# EasyEDA Pro project power_suply.eprj

# Schematic Schematic1
Board Name: Board1; Create Date: 2025-09-13; Page Name: main board; Project Name: power_suply; Schematic Name: Schematic1; Update Date: 2025-09-17; Company: EasyEDA.com; Page Size: A4; Version: V1.0
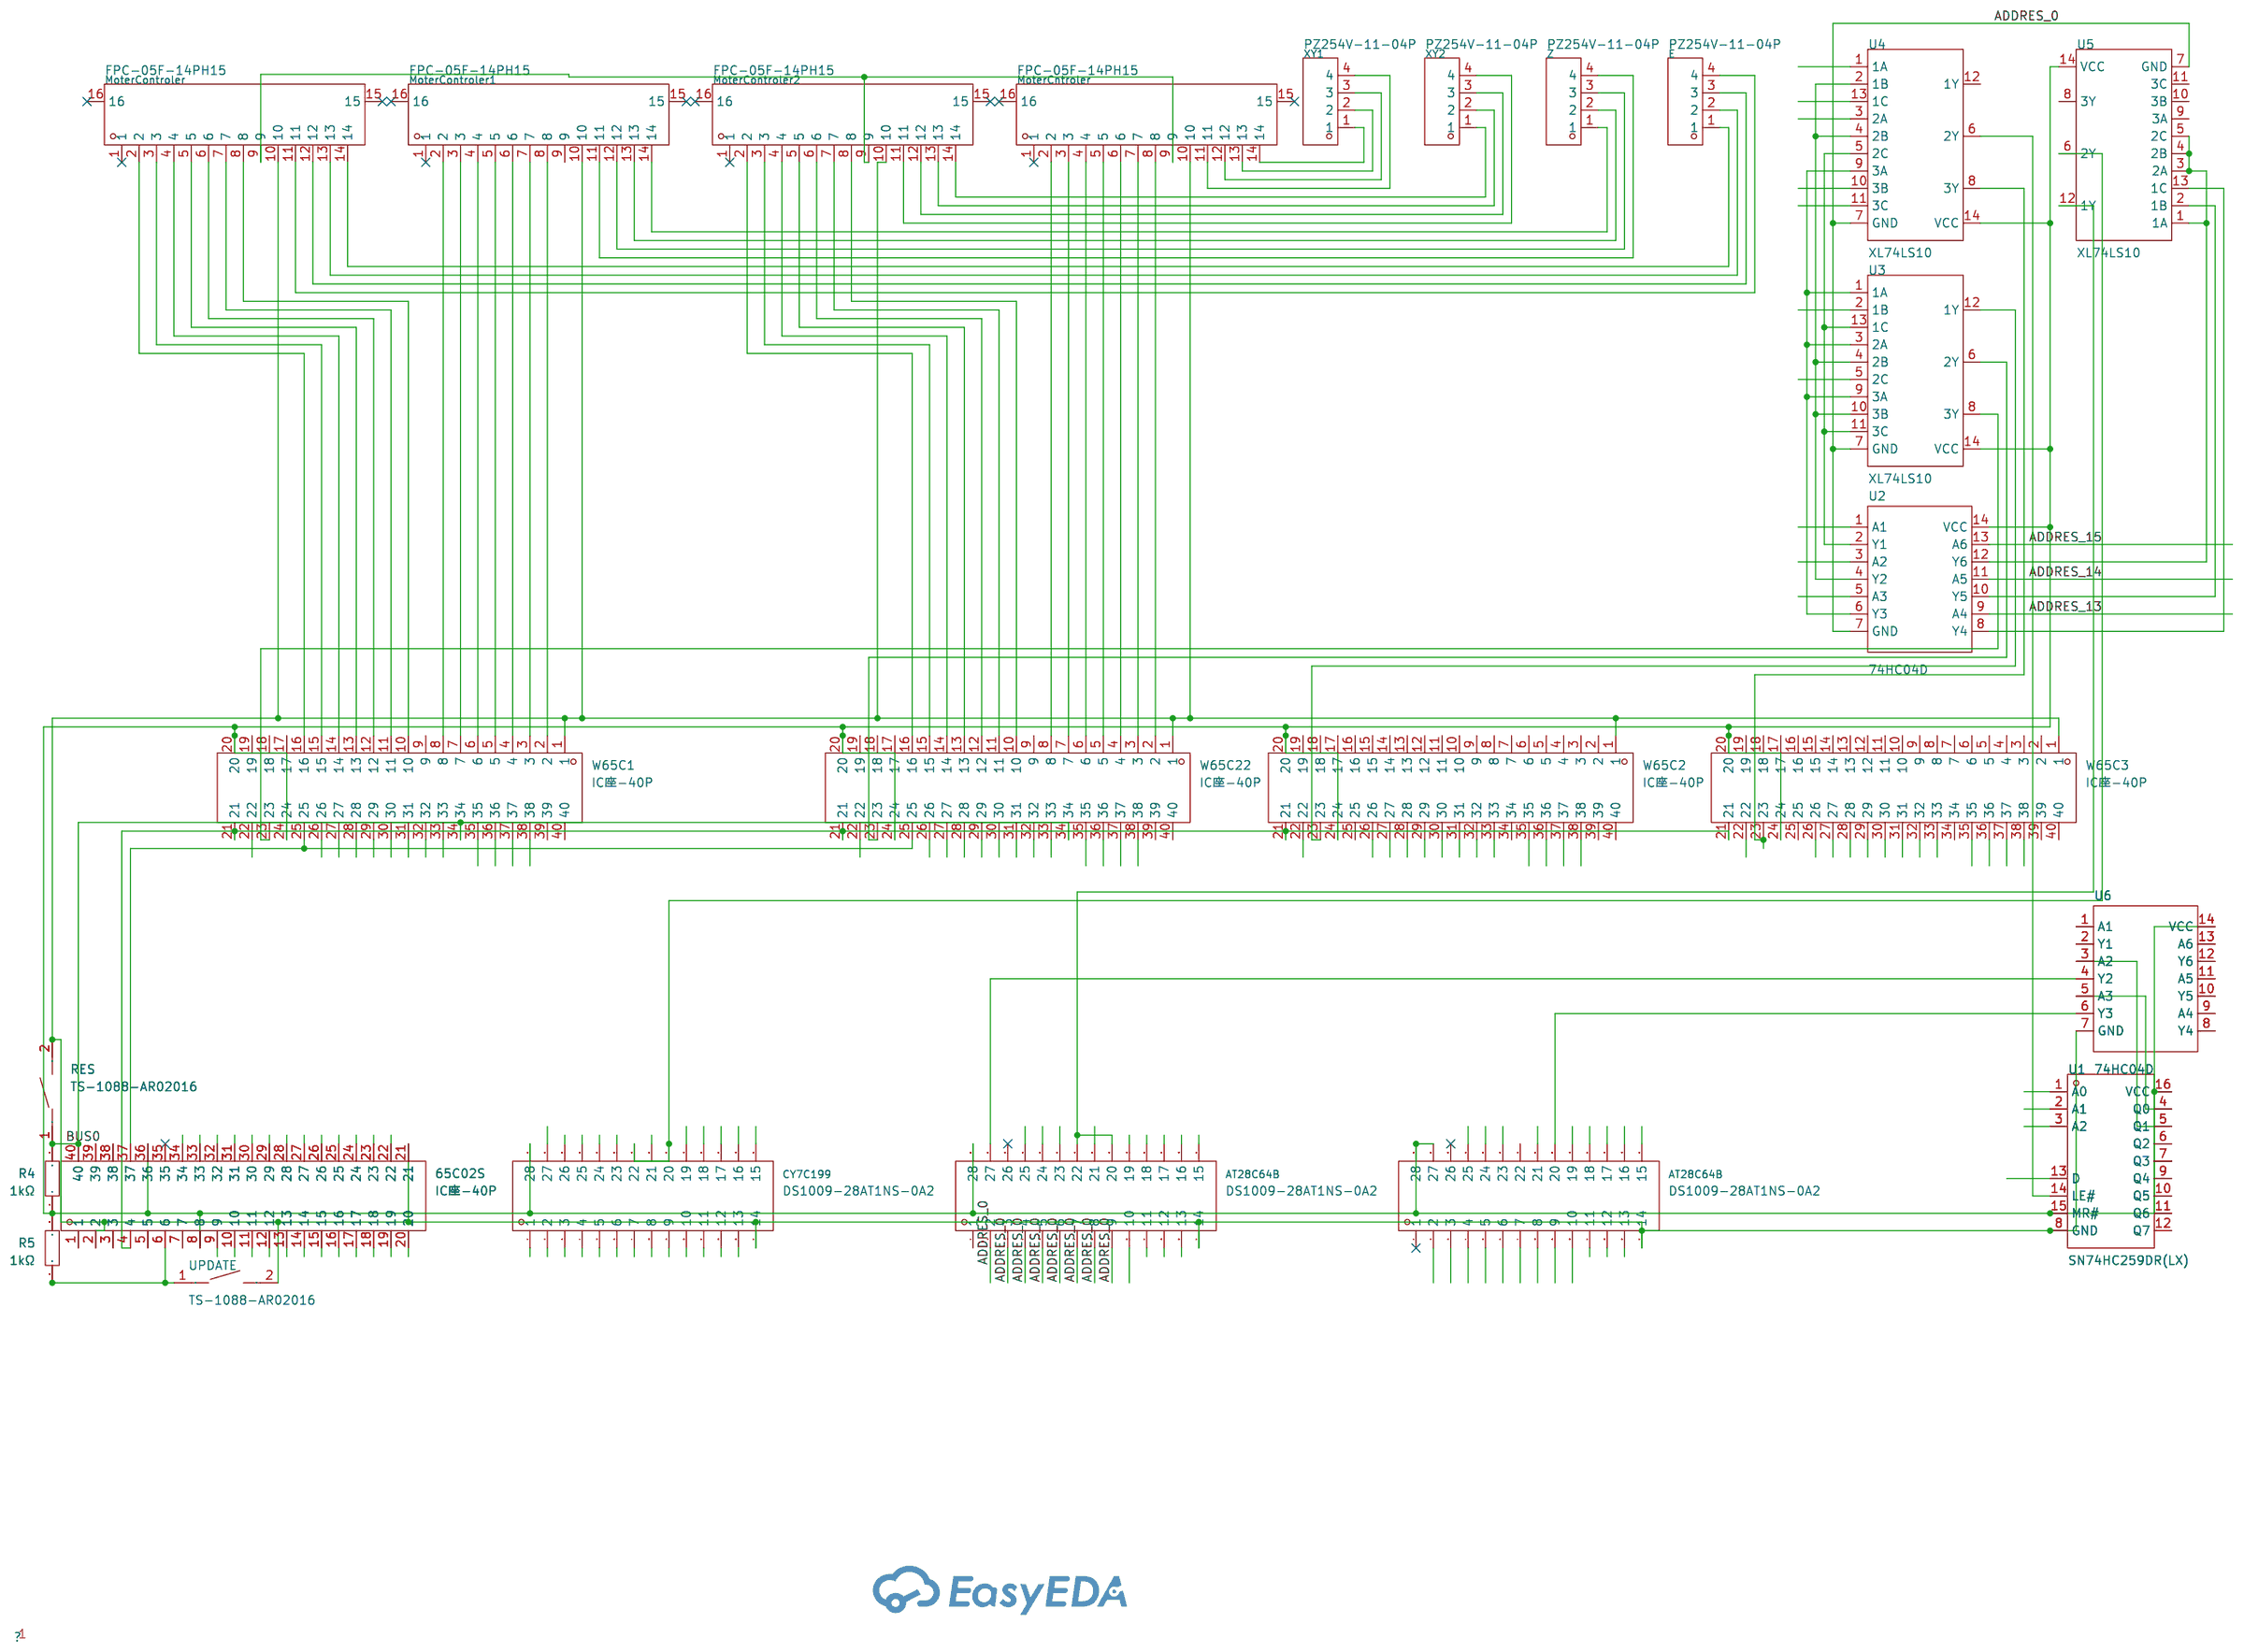
[diagram p0: schematic sheet]

## Parts
65C02S  IC座-40P  [DIP-40_L50.8-W17.8-P2.54-LS15.2-BL]
AT28C64B  DS1009-28AT1NS-0A2  [DIP-28_L35.6-W10.2-P2.54-LS7.6-BL-2]
AT28C64B#2  DS1009-28AT1NS-0A2  [DIP-28_L35.6-W10.2-P2.54-LS7.6-BL-2]
CY7C199  DS1009-28AT1NS-0A2  [DIP-28_L35.6-W10.2-P2.54-LS7.6-BL-2]
E  PZ254V-11-04P  [HDR-TH_4P-P2.54-V-M]
MoterCntroler  FPC-05F-14PH15  [FPC-SMD_14P-P0.50_XUNPU_FPC-05F-14PH15]
MoterControler  FPC-05F-14PH15  [FPC-SMD_14P-P0.50_XUNPU_FPC-05F-14PH15]
MoterControler1  FPC-05F-14PH15  [FPC-SMD_14P-P0.50_XUNPU_FPC-05F-14PH15]
MoterControler2  FPC-05F-14PH15  [FPC-SMD_14P-P0.50_XUNPU_FPC-05F-14PH15]
R4  1kΩ  [R0603]
R5  1kΩ  [R0603]
RES  TS-1088-AR02016  [SW-SMD_L3.9-W3.0-P4.45]
U1  SN74HC259DR(LX)  [SOP-16_L9.9-W3.9-P1.27-LS6.0-BL]
U2  74HC04D  [DIP-14_L19.2-W6.6-P2.54-LS10.9-BL]
U3  XL74LS10  [SOP-14_L8.6-W3.9-P1.27-LS6.0-BL]
U4  XL74LS10  [SOP-14_L8.6-W3.9-P1.27-LS6.0-BL]
U5  XL74LS10  [SOP-14_L8.6-W3.9-P1.27-LS6.0-BL]
U6  74HC04D  [DIP-14_L19.2-W6.6-P2.54-LS10.9-BL]
UPDATE  TS-1088-AR02016  [SW-SMD_L3.9-W3.0-P4.45]
W65C1  IC座-40P  [DIP-40_L50.8-W17.8-P2.54-LS15.2-BL]
W65C2  IC座-40P  [DIP-40_L50.8-W17.8-P2.54-LS15.2-BL]
W65C3  IC座-40P  [DIP-40_L50.8-W17.8-P2.54-LS15.2-BL]
W65C22  IC座-40P  [DIP-40_L50.8-W17.8-P2.54-LS15.2-BL]
XY1  PZ254V-11-04P  [HDR-TH_4P-P2.54-V-M]
XY2  PZ254V-11-04P  [HDR-TH_4P-P2.54-V-M]
Z  PZ254V-11-04P  [HDR-TH_4P-P2.54-V-M]

## Library data of the parts
65C02S W65C22 = IC座-40P: LCSC Part Name: 间距2.54mm P数:40P; Supplier Part: C2332; Manufacturer: BOOMELE(博穆精密); Supplier Footprint: DIP-40; JLCPCB Part Class: Extended Part; Datasheet: https://item.szlcsc.com/datasheet/IC%25E5%25BA%25A7-40P/2706.html; Supplier: LCSC; Adaptation Package Type: DIP; Pitch: 2.54mm; Row Spacing: 15.24mm; Number of Positions: 40P
AT28C64B CY7C199 = DS1009-28AT1NS-0A2: LCSC Part Name: 间距2.54mm P数:28P; Supplier Part: C72125; Manufacturer: CONNFLY; Supplier Footprint: DIP-28; JLCPCB Part Class: Extended Part; Datasheet: https://atta.szlcsc.com/upload/public/pdf/source/20160429/1461922462758.pdf; Supplier: LCSC; IC Type: DIP; Pitch: 2.54mm; Row Spacing: 7.62mm; Number of Positions: 28P; Contact Plating: Tin
AT28C64B#2 = DS1009-28AT1NS-0A2: AT28C64B; LCSC Part Name: 间距2.54mm P数:28P; Supplier Part: C72125; Manufacturer: CONNFLY; Supplier Footprint: DIP-28; JLCPCB Part Class: Extended Part; Datasheet: https://atta.szlcsc.com/upload/public/pdf/source/20160429/1461922462758.pdf; Supplier: LCSC; IC Type: DIP; Pitch: 2.54mm; Row Spacing: 7.62mm; Number of Positions: 28P; Contact Plating: Tin
E XY1 XY2 Z = PZ254V-11-04P: LCSC Part Name: 1x4P 间距:2.54mm 方针 直插; Supplier Part: C2691448; Manufacturer: XFCN(兴飞); Supplier Footprint: 插件,P=2.54mm; JLCPCB Part Class: Extended Part; Datasheet: https://item.szlcsc.com/datasheet/PZ254V-11-04P/2801085.html; Supplier: LCSC; Pin Structure: 1x4P; Pitch: 2.54mm; Circluar Pins/Square Pins: Pin Header; Mounting Type: Through Hole; Number of Rows: 1; Number of Pins: 4P; Current Rating: 3A; Voltage Rating (Max): 250V; Length of Mating Pin: 6mm; Insulation Height: 2.5mm; Length of End Connection Pin: 3mm; Operating Temperature: -40℃~+105℃; Color: Black
MoterCntroler MoterControler MoterControler1 MoterControler2 = FPC-05F-14PH15: Moter Controler; LCSC Part Name: 翻盖式 卧贴 P数:14P 间距:0.5mm; Supplier Part: C2856818; Manufacturer: XUNPU(讯普); Supplier Footprint: SMD,P=0.5mm,卧贴; JLCPCB Part Class: Extended Part; Datasheet: https://item.szlcsc.com/datasheet/FPC-05F-14PH15/3056916.html; Supplier: LCSC; Locking Feature: Hinged Lid; Contact Type: Surface Mount; Number of Contacts: 14P; Pitch: 0.5mm; Mounting Type: Bottom Contact; FFC, FCB Thickness: 0.3mm; Height Above Board: 1.5mm; Contact Material: Phosphor Bronze; Contact Plating: Tin; Operating Temperature: -25℃~+85℃; Rated Voltage (Max): 50V; Current Rating (Max): 500mA
R4 R5 = 0603WAF1001T5E: LCSC Part Name: 1kΩ ±1% 100mW 厚膜电阻; Supplier Part: C21190; Manufacturer: UNI-ROYAL(厚声); Supplier Footprint: 0603; JLCPCB Part Class: Basic Part; Datasheet: https://atta.szlcsc.com/upload/public/pdf/source/20200306/C422600_1E6D84923E4A46A82E41ADD87F860B5C.pdf; Supplier: LCSC; Type: Thick Film Resistors; Tolerance: ±1%; Temperature Coefficient: ±100ppm/℃; Operating Temperature Range: -55℃~+155℃
RES UPDATE = TS-1088-AR02016: LCSC Part Name: 4*3*2mm 立贴 轻触开关; Supplier Part: C720477; Manufacturer: XUNPU(讯普); Supplier Footprint: SMD; JLCPCB Part Class: Basic Part; Datasheet: https://item.szlcsc.com/datasheet/TS-1088-AR02016/763484.html; Supplier: LCSC; Circuit: SPST; Actuator Style: Round Button; Operating Force: 1.6N; Mounting Type: Surface Mount,Vertical; Length: 4mm; Width: 3mm; Switch Height: 2mm; with Bracket: Without Bracket; Contact Current: 50mA; Voltage Rating: 12V; Actuator/Cap Color: Black; Termination Style: SMD(SMT) Tab; Life: 100,000 Cycles; Operating Temperature: -30℃~+80℃
U1 = SN74HC259DR(LX): Supplier Part: C32710652; Manufacturer: LX(灵星芯微); Supplier Footprint: SOP-16; JLCPCB Part Class: Extended Part; Datasheet: https://atta.szlcsc.com/upload/public/pdf/source/20240723/020EC5FF42751C43869D4F58E5A5A1D0.pdf; Supplier: LCSC; Logic Type: Addressable Latch; Voltage - Supply: 2V~6V; Number of Channels: 8; Propagation Delay: 31ns; Series: 74HCSeries; Operating Temperature: -40℃~+125℃
U2 U6 = 74HC04D_C19818860: Supplier Part: C19818860; Manufacturer: GR(国睿); Supplier Footprint: DIP-14; JLCPCB Part Class: Extended Part; Datasheet: https://atta.szlcsc.com/upload/public/pdf/source/20231226/2835AD12A43460DBAB3011469544A46D.pdf; Supplier: LCSC; Voltage - Supply: 2V~6V; Current - Supply: 5.5uA; Number of Circuits: 6; Number of Inputs: 6; Current - Output Low(IOL): 5.2mA; Current - Output High(IOH): 5.2mA; Series: 74HCSeries
U3-U5 = XL74LS10: Supplier Part: C521173; Manufacturer: XINLUDA(信路达); Supplier Footprint: SOP-14; JLCPCB Part Class: Extended Part; Datasheet: https://item.szlcsc.com/datasheet/XL74LS10/538132.html; Supplier: LCSC
W65C1-W65C3 = IC座-40P: W65C22; LCSC Part Name: 间距2.54mm P数:40P; Supplier Part: C2332; Manufacturer: BOOMELE(博穆精密); Supplier Footprint: DIP-40; JLCPCB Part Class: Extended Part; Datasheet: https://item.szlcsc.com/datasheet/IC%25E5%25BA%25A7-40P/2706.html; Supplier: LCSC; Adaptation Package Type: DIP; Pitch: 2.54mm; Row Spacing: 15.24mm; Number of Positions: 40P

## Nets
ADDRES_0: 65C02S.9 AT28C64B.2 AT28C64B.3 AT28C64B.4 AT28C64B.5 AT28C64B.6 AT28C64B.7 AT28C64B.8 AT28C64B.9 AT28C64B.10 AT28C64B#2.10 CY7C199.1 CY7C199.21 U2.1(A1) U2.7(GND) U3.5(2C) U3.7(GND) U4.7(GND) U4.11(3C) U4.13(1C) U5.7(GND)
ADDRES_1: 65C02S.10 AT28C64B#2.9 CY7C199.2 U2.3(A2) U3.2(1B) U4.10(3B)
ADDRES_2: 65C02S.11 AT28C64B#2.8 CY7C199.3 U2.5(A3) U4.1(1A) U4.3(2A)
ADDRES_3: 65C02S.12 AT28C64B#2.7 CY7C199.4 U1.1(A0) W65C1.38 W65C2.38 W65C3.38 W65C22.38
ADDRES_4: 65C02S.13 AT28C64B#2.6 AT28C64B#2.24 AT28C64B#2.25 CY7C199.5 U1.2(A1) W65C1.37 W65C2.37 W65C3.37 W65C22.37
ADDRES_5: 65C02S.14 AT28C64B#2.5 AT28C64B#2.21 AT28C64B#2.23 CY7C199.6 U1.3(A2) W65C1.36 W65C2.36 W65C3.36 W65C22.36
ADDRES_6: 65C02S.15 AT28C64B.25 AT28C64B#2.4 CY7C199.7 W65C1.35 W65C2.35 W65C3.35 W65C22.35
ADDRES_7: 65C02S.16 AT28C64B.24 AT28C64B#2.3 CY7C199.8
ADDRES_8: 65C02S.17 AT28C64B.23 CY7C199.9
ADDRES_9: 65C02S.18 AT28C64B.21 CY7C199.10
ADDRES_10: 65C02S.19 CY7C199.23
ADDRES_11: 65C02S.20 CY7C199.24
ADDRES_12: 65C02S.22 AT28C64B#2.2 CY7C199.25
ADDRES_13: 65C02S.23 CY7C199.26 U2.9(A4)
ADDRES_14: 65C02S.24 U2.11(A5)
ADDRES_15: 65C02S.25 U2.13(A6)
BUS0: 65C02S.40 R4.2 RES.1 W65C1.34 W65C22.34
DATA_0: 65C02S.26 AT28C64B.18 CY7C199.11 U1.13(D) W65C1.33 W65C2.33 W65C3.33 W65C22.33
DATA_1: 65C02S.27 AT28C64B.17 AT28C64B#2.19 CY7C199.12 W65C1.32 W65C2.32 W65C3.32 W65C22.32
DATA_2: 65C02S.28 AT28C64B.16 AT28C64B#2.13 CY7C199.13 W65C1.31 W65C2.31 W65C3.31 W65C22.31
DATA_3: 65C02S.29 AT28C64B.15 AT28C64B#2.15 CY7C199.15 W65C1.30 W65C2.30 W65C3.30 W65C22.30
DATA_4: 65C02S.30 AT28C64B.12 AT28C64B.13 AT28C64B#2.16 CY7C199.16 W65C1.29 W65C2.29 W65C3.29 W65C22.29
DATA_5: 65C02S.31 AT28C64B#2.17 CY7C199.17 W65C1.28 W65C2.28 W65C3.28 W65C22.28
DATA_6: 65C02S.32 AT28C64B.11 AT28C64B#2.18 CY7C199.18 W65C1.27 W65C2.27 W65C3.27 W65C22.27
DATA_7: 65C02S.33 AT28C64B#2.12 CY7C199.19 W65C1.26 W65C2.26 W65C3.26 W65C22.26
DATA_8: 65C02S.34 AT28C64B.19 AT28C64B.20 AT28C64B.22 AT28C64B#2.11 CY7C199.27 U5.12(1Y) W65C1.22 W65C2.22 W65C3.22 W65C22.22
$2N12247: U1.4(Q0) U6.5(A3)
$2N12601: U1.5(Q1) U6.3(A2)
A1B: U2.4(Y2) U3.4(2B) U3.10(3B) U4.2(1B) U4.4(2B)
A13B: U2.8(Y4) U5.13(1C)
A14B: U2.10(Y5) U5.2(1B)
A15B: U2.12(Y6) U5.1(1A) U5.3(2A) U5.4(2B) U5.5(2C)
IRQB: 65C02S.4 W65C1.21 W65C2.21 W65C3.21 W65C22.21
LE: U1.14(LE#) U4.6(2Y)
Net-(65C02S-2): 65C02S.2 65C02S.21 AT28C64B.14 AT28C64B#2.14 CY7C199.14 MoterCntroler.10 MoterControler.10 MoterControler1.10 MoterControler2.10 RES.2 U1.8(GND) U6.7(GND) UPDATE.2 W65C1.1 W65C2.1 W65C3.1 W65C22.1
Net-(65C02S-8): 65C02S.8 65C02S.36 AT28C64B.28 AT28C64B#2.27 AT28C64B#2.28 CY7C199.28 R4.1 R5.2 U1.15(MR#) U1.16(VCC) U2.14(VCC) U3.14(VCC) U4.14(VCC) U5.14(VCC) U6.14(VCC) W65C1.20 W65C1.24 W65C2.20 W65C2.24 W65C3.20 W65C3.24 W65C22.20 W65C22.24
Net-(65C02S-37): 65C02S.37 W65C1.25 W65C22.25
Net-(AT28C64B#2-20): AT28C64B#2.20 U6.6(Y3)
Net-(AT28C64B-27): AT28C64B.27 U6.4(Y2)
Net-(E-1): E.1 MoterControler.14
Net-(E-2): E.2 MoterControler.13
Net-(E-3): E.3 MoterControler.12
Net-(E-4): E.4 MoterControler.11
Net-(MoterCntroler-2): MoterCntroler.2 W65C22.8
Net-(MoterCntroler-3): MoterCntroler.3 W65C22.7
Net-(MoterCntroler-4): MoterCntroler.4 W65C22.6
Net-(MoterCntroler-5): MoterCntroler.5 W65C22.5
Net-(MoterCntroler-6): MoterCntroler.6 W65C22.4
Net-(MoterCntroler-7): MoterCntroler.7 W65C22.3
Net-(MoterCntroler-8): MoterCntroler.8 W65C22.2
Net-(MoterCntroler-9): MoterCntroler.9 MoterControler.9 MoterControler2.9
Net-(MoterCntroler-11): MoterCntroler.11 XY1.4
Net-(MoterCntroler-12): MoterCntroler.12 XY1.3
Net-(MoterCntroler-13): MoterCntroler.13 XY1.2
Net-(MoterCntroler-14): MoterCntroler.14 XY1.1
Net-(MoterControler1-2): MoterControler1.2 W65C1.8
Net-(MoterControler1-3): MoterControler1.3 W65C1.7
Net-(MoterControler1-4): MoterControler1.4 W65C1.6
Net-(MoterControler1-5): MoterControler1.5 W65C1.5
Net-(MoterControler1-6): MoterControler1.6 W65C1.4
Net-(MoterControler1-7): MoterControler1.7 W65C1.3
Net-(MoterControler1-8): MoterControler1.8 W65C1.2
Net-(MoterControler1-11): MoterControler1.11 Z.4
Net-(MoterControler1-12): MoterControler1.12 Z.3
Net-(MoterControler1-13): MoterControler1.13 Z.2
Net-(MoterControler1-14): MoterControler1.14 Z.1
Net-(MoterControler2-2): MoterControler2.2 W65C22.16
Net-(MoterControler2-3): MoterControler2.3 W65C22.15
Net-(MoterControler2-4): MoterControler2.4 W65C22.14
Net-(MoterControler2-5): MoterControler2.5 W65C22.13
Net-(MoterControler2-6): MoterControler2.6 W65C22.12
Net-(MoterControler2-7): MoterControler2.7 W65C22.11
Net-(MoterControler2-8): MoterControler2.8 W65C22.10
Net-(MoterControler2-11): MoterControler2.11 XY2.4
Net-(MoterControler2-12): MoterControler2.12 XY2.3
Net-(MoterControler2-13): MoterControler2.13 XY2.2
Net-(MoterControler2-14): MoterControler2.14 XY2.1
Net-(MoterControler-2): MoterControler.2 W65C1.16
Net-(MoterControler-3): MoterControler.3 W65C1.15
Net-(MoterControler-4): MoterControler.4 W65C1.14
Net-(MoterControler-5): MoterControler.5 W65C1.13
Net-(MoterControler-6): MoterControler.6 W65C1.12
Net-(MoterControler-7): MoterControler.7 W65C1.11
Net-(MoterControler-8): MoterControler.8 W65C1.10
Net-(U2-2): U2.2(Y1) U3.11(3C) U3.13(1C) U4.5(2C)
Net-(U2-6): U2.6(Y3) U3.1(1A) U3.3(2A) U3.9(3A) U4.9(3A)
Net-(U3-6): U3.6(2Y) W65C22.23
Net-(U3-12): U3.12(1Y) W65C2.23
RAMEB: CY7C199.20 CY7C199.22 U5.6(2Y)
VIA0EB: U3.8(3Y) W65C1.23
VIA3EB: U4.8(3Y) W65C3.23

Not connected (* = marked no-connect by the designer): 65C02S 1 3 5 6 7 35* 38 39; AT28C64B 1 26*; AT28C64B#2 1* 22 26*; MoterCntroler 1* 15* 16*; MoterControler 1* 15* 16*; MoterControler1 1* 9 15* 16*; MoterControler2 1* 15* 16*; R5 1; U1 6(Q2) 7(Q3) 9(Q4) 10(Q5) 11(Q6) 12(Q7); U4 12(1Y); U5 8(3Y) 9(3A) 10(3B) 11(3C); U6 1(A1) 2(Y1) 8(Y4) 9(A4) 10(Y5) 11(A5) 12(Y6) 13(A6); UPDATE 1; W65C1 9 17 18 19 39 40; W65C2 2 3 4 5 6 7 8 9 10 11 12 13 14 15 16 17 18 19 25 34 39 40; W65C3 2 3 4 5 6 7 8 9 10 11 12 13 14 15 16 17 18 19 25 34 39 40; W65C22 9 17 18 19 39 40

# Schematic Schematic2
Board Name: Board2; Create Date: 2025-09-15; Page Name: moter controler; Project Name: power_suply; Schematic Name: Schematic2; Update Date: 2025-09-15; Company: EasyEDA.com; Page Size: A4; Version: V1.0
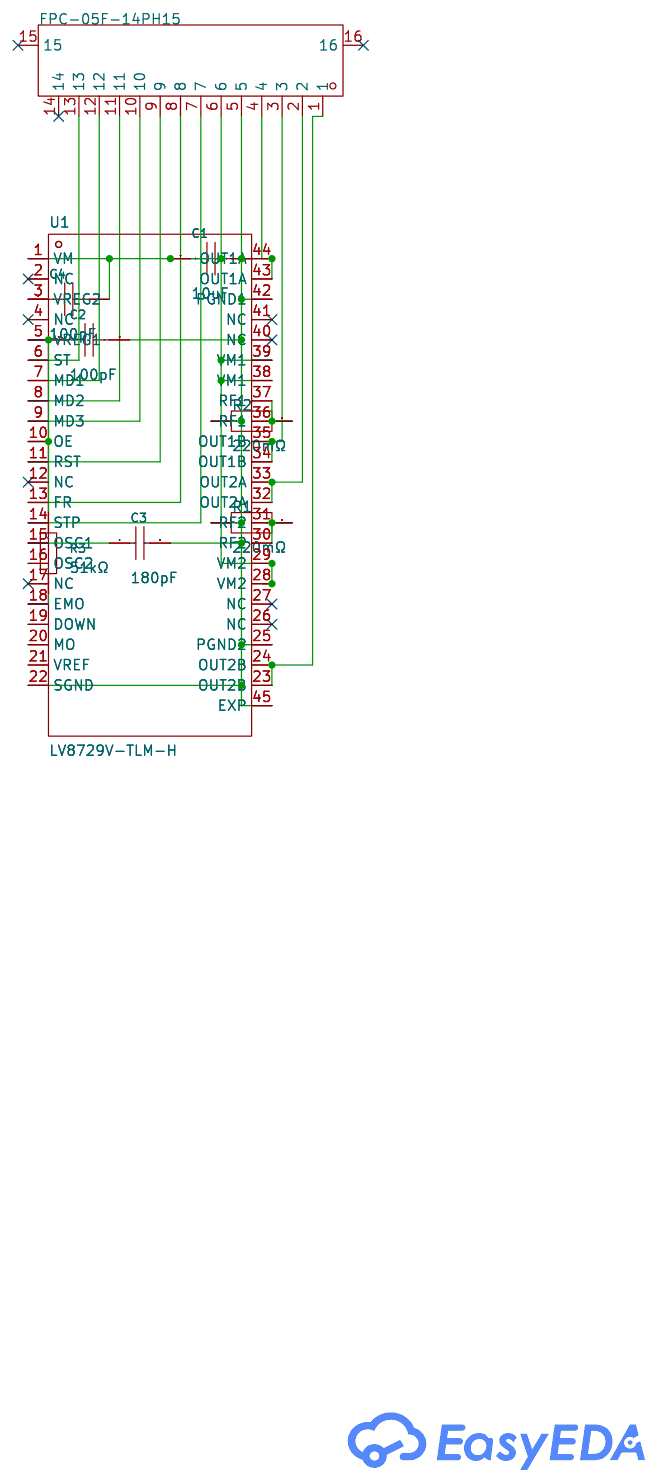
[diagram p1: schematic sheet]

## Parts
C1  10uF  [C0603]
C2  100pF  [C0603]
C3  180pF  [C0603]
C4  100pF  [C0603]
FPC1  FPC-05F-14PH15  [FPC-SMD_14P-P0.50_XUNPU_FPC-05F-14PH15]
R1  220mΩ  [R1206]
R2  220mΩ  [R1206]
R3  51kΩ  [R0603]
U1  LV8729V-TLM-H  [SSOP-44_L15.5-W5.6-P0.65-LS7.6-BL-EP]

## Library data of the parts
C1 = CL10A106MQ8NNNC: LCSC Part Name: 10uF ±20% 6.3V; Supplier Part: C1691; Manufacturer: SAMSUNG(三星); Supplier Footprint: 0603; JLCPCB Part Class: Extended Part; Datasheet: https://item.szlcsc.com/datasheet/CL10A106MQ8NNNC/2043.html; Supplier: LCSC; Tolerance: ±20%; Voltage Rating: 6.3V; Temperature Coefficient: X5R
C2 C4 = CC0603JRNPO9BN101: LCSC Part Name: 100pF ±5% 50V; Supplier Part: C14665; Manufacturer: YAGEO(国巨); Supplier Footprint: 0603; JLCPCB Part Class: Extended Part; Datasheet: https://atta.szlcsc.com/upload/public/pdf/source/20181008/C309499_21CC21451B82C39E3D92150FD6B30293.pdf; Supplier: LCSC; Tolerance: ±5%
C3 = CC0603JRNPO9BN181: LCSC Part Name: 180pF ±5% 50V; Supplier Part: C107041; Manufacturer: YAGEO(国巨); Supplier Footprint: 0603; JLCPCB Part Class: Extended Part; Datasheet: https://item.szlcsc.com/datasheet/CC0603JRNPO9BN181/108257.html; Supplier: LCSC; Tolerance: ±5%; Voltage Rating: 50V; Temperature Coefficient: NP0
FPC1 = FPC-05F-14PH15: LCSC Part Name: 翻盖式 卧贴 P数:14P 间距:0.5mm; Supplier Part: C2856818; Manufacturer: XUNPU(讯普); Supplier Footprint: SMD,P=0.5mm,卧贴; JLCPCB Part Class: Extended Part; Datasheet: https://item.szlcsc.com/datasheet/FPC-05F-14PH15/3056916.html; Supplier: LCSC; Locking Feature: Hinged Lid; Contact Type: Surface Mount; Number of Contacts: 14P; Pitch: 0.5mm; Mounting Type: Bottom Contact; FFC, FCB Thickness: 0.3mm; Height Above Board: 1.5mm; Contact Material: Phosphor Bronze; Contact Plating: Tin; Operating Temperature: -25℃~+85℃; Rated Voltage (Max): 50V; Current Rating (Max): 500mA
R1 R2 = FRL1206FR220TS: LCSC Part Name: 220mΩ ±1% 250mW 厚膜电阻; Supplier Part: C2907349; Manufacturer: FOJAN(富捷); Supplier Footprint: 1206; JLCPCB Part Class: Extended Part; Supplier: LCSC; Type: Thick Film Resistor; Tolerance: ±1%; Power(Watts): 250mW; Voltage-Supply(Max): 500V; Temperature Coefficient: ±300ppm/℃; Operating Temperature: -55℃~+155℃
R3 = 0603WAF5102T5E: LCSC Part Name: 51kΩ ±1% 100mW 厚膜电阻; Supplier Part: C23196; Manufacturer: UNI-ROYAL(厚声); Supplier Footprint: 0603; JLCPCB Part Class: Basic Part; Datasheet: https://item.szlcsc.com/datasheet/0603WAF5102T5E/23923.html; Supplier: LCSC; Type: Thick Film Resistor; Tolerance: ±1%; Power(Watts): 100mW; Voltage-Supply(Max): 75V; Temperature Coefficient: ±100ppm/℃; Operating Temperature: -55℃~+155℃
U1 = LV8729V-TLM-H: Supplier Part: C77586; Manufacturer: onsemi(安森美); Supplier Footprint: SSOP-44-EP-5.6mm; JLCPCB Part Class: Extended Part; Datasheet: https://item.szlcsc.com/datasheet/LV8729V-TLM-H/78715.html; Supplier: LCSC; Control Voltage: 0V~5V; Motor Drive Voltage(Vm): 9V~32V; Output Current: 1.8A; Drive Type: Bipolar Driver; Step Resolution: 32; Interface: STEP/DIR; Technology: Yes; RDS(on): 650mΩ; Operating Temperature: -30℃~+85℃

## Nets
12V: C1.2 C4.2 FPC1.6 U1.1(VM) U1.28(VM2) U1.29(VM2) U1.38(VM1) U1.39(VM1)
GND: C1.1 C2.2 C3.2 FPC1.5 R1.1 R2.1 U1.22(SGND) U1.25(PGND2) U1.42(PGND1) U1.45(EXP)
$2N1474: R3.1 U1.18(EMO)
$2N1496: R1.2 U1.30(RF2) U1.31(RF2)
$2N1498: R2.2 U1.36(RF1) U1.37(RF1)
$2N2039: C4.1 U1.3(VREG2)
$2N2111: C3.1 U1.15(OSC1)
$2N2921: C2.1 R3.2 U1.5(VREG1) U1.10(OE)
C1: FPC1.2 U1.32(OUT2A) U1.33(OUT2A)
C1B: FPC1.1 U1.23(OUT2B) U1.24(OUT2B)
C2: FPC1.4 U1.43(OUT1A) U1.44(OUT1A)
C2B: FPC1.3 U1.34(OUT1B) U1.35(OUT1B)
Net-(FPC1-7): FPC1.7 U1.14(STP)
Net-(FPC1-8): FPC1.8 U1.13(FR)
Net-(FPC1-9): FPC1.9 U1.11(RST)
Net-(FPC1-10): FPC1.10 U1.9(MD3)
Net-(FPC1-11): FPC1.11 U1.8(MD2)
Net-(FPC1-12): FPC1.12 U1.7(MD1)
Net-(FPC1-13): FPC1.13 U1.6(ST)

Not connected (* = marked no-connect by the designer): FPC1 14* 15* 16*; U1 2(NC)* 4(NC)* 12(NC)* 16(OSC2) 17(NC)* 19(DOWN) 20(MO) 21(VREF) 26(NC)* 27(NC)* 40(NC)* 41(NC)*

# Board PCB1
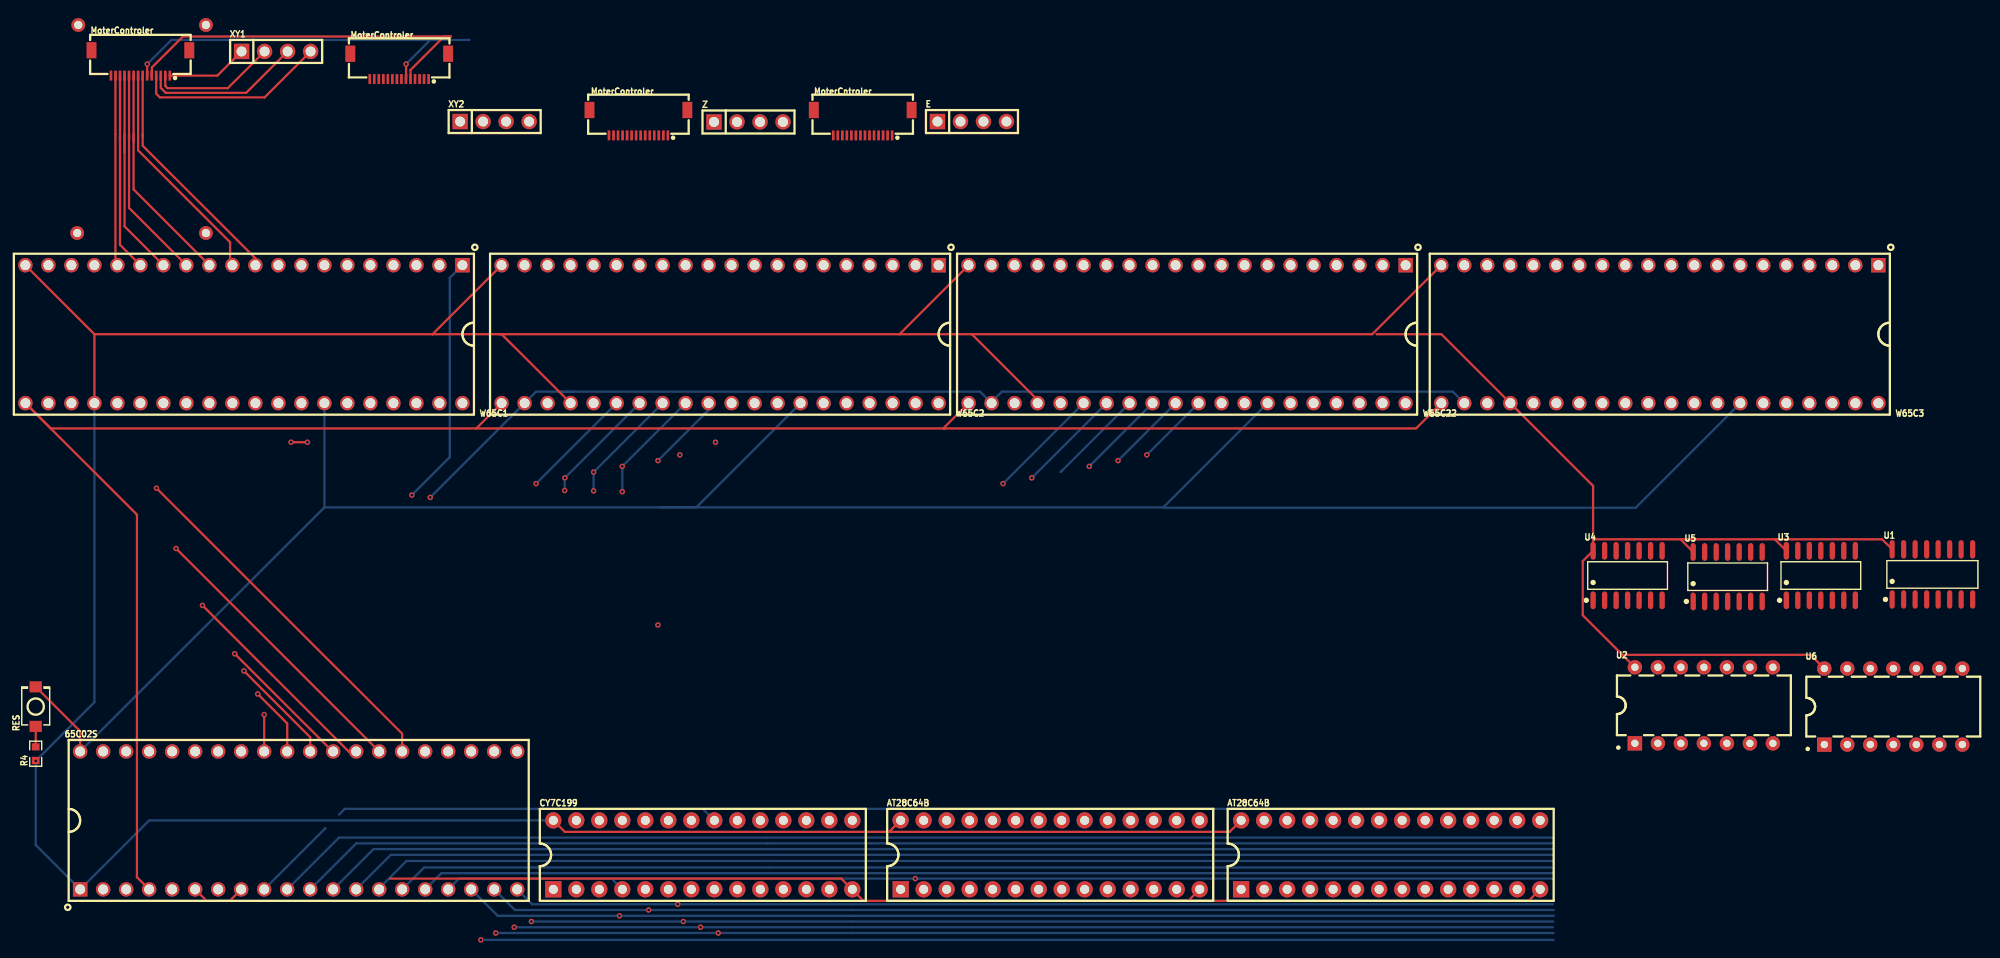
[diagram p2: board, top side]
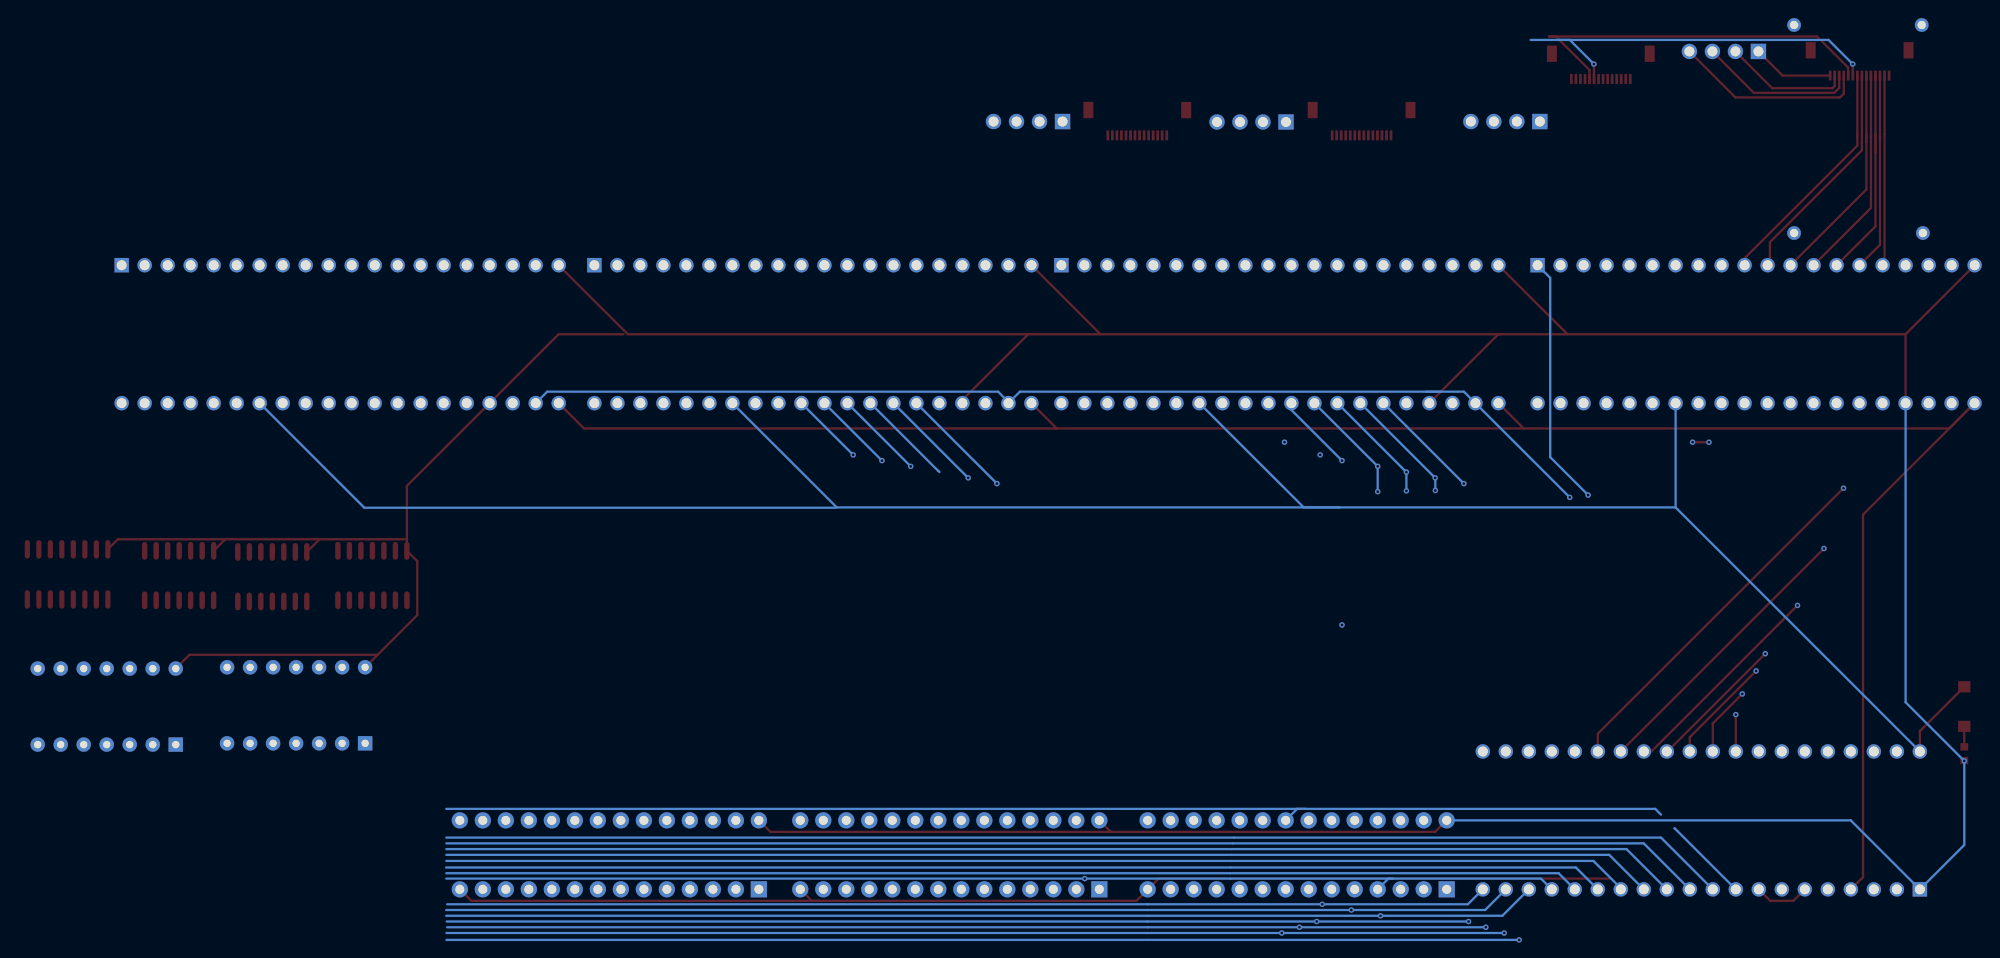
[diagram p3: board, bottom side, seen from below]

No outline. copper layers: Top Layer, Inner1, Inner2, Bottom Layer. Coordinates in mm from the lowest, leftmost part position.
Stack: Top Layer 0.035mm Outer layer thickness 1oz / Dielectric1 0.2104mm 7628 RC49% 8.6mil / Inner1 0.0152mm Inner layer thickness / Dielectric2 1.065mm 1.1mm H/HOZ Copper / Inner2 0.0152mm Inner layer thickness / Dielectric3 0.2104mm 7628 RC49% 8.6mil / Bottom Layer 0.035mm Outer layer thickness 1oz

## Design rules (mm)
template: JLCPCB Capability(Two Layers Board)
spacing copperThickness1oz (default): track to track 0.102, other pairs 0.152 to 0.3
spacing copperThickness2oz: track to track 0.203, other pairs 0.152 to 0.3
track width copperThickness1oz (default): min 0.127, default 0.254, max 2.54
track width copperThickness2oz: min 0.203, default 0.254, max 2.54
differential pair differentialPair (default): width min 0.127, default 0.254, max 2.54; gap min 0.152, default 0.152
via viaSize (default): diameter min 0.5, default 0.61, max 10; hole min 0.3, default 0.305, max 6.3

## Placement (name value [footprint] x y rotation side)
65C02S  IC座-40P  [DIP-40_L50.8-W17.8-P2.54-LS15.2-BL]  29.04 3.8 0 top
AT28C64B  DS1009-28AT1NS-0A2  [DIP-28_L35.6-W10.2-P2.54-LS7.6-BL-2]  112.01 0 0 top
AT28C64B#2  DS1009-28AT1NS-0A2  [DIP-28_L35.6-W10.2-P2.54-LS7.6-BL-2]  149.61 0 0 top
CY7C199  DS1009-28AT1NS-0A2  [DIP-28_L35.6-W10.2-P2.54-LS7.6-BL-2]  73.66 0 0 top
E  PZ254V-11-04P  [HDR-TH_4P-P2.54-V-M]  103.38 81.03 0 top
MoterCntroler  FPC-05F-14PH15  [FPC-SMD_14P-P0.50_XUNPU_FPC-05F-14PH15]  91.31 80.9 180 top
MoterControler  FPC-05F-14PH15  [FPC-SMD_14P-P0.50_XUNPU_FPC-05F-14PH15]  40.13 87.12 180 top
MoterControler#2  -  [FPC-SMD_14P-P0.50_XUNPU_FPC-05F-14PH15]  11.56 87.5 180 top
MoterControler#3  -  [FPC-SMD_14P-P0.50_XUNPU_FPC-05F-14PH15]  66.55 80.9 180 top
NOREF  -  [Pad_e65]  4.57 68.71 0 top
NOREF#2  -  [Pad_e66]  18.8 68.71 0 top
NOREF#3  -  [Pad_e67]  18.8 91.69 0 top
NOREF#4  -  [Pad_e68]  4.7 91.69 0 top
R4  1kΩ  [R0603]  0 11.18 90 top
RES  TS-1088-AR02016  [SW-SMD_L3.9-W3.0-P4.45]  0 16.38 90 top
U1  SN74HC259DR(LX)  [SOP-16_L9.9-W3.9-P1.27-LS6.0-BL]  209.42 30.99 0 top
U2  74HC04D  [DIP-14_L19.2-W6.6-P2.54-LS10.9-BL]  184.19 16.52 0 top
U3  XL74LS10  [SOP-14_L8.6-W3.9-P1.27-LS6.0-BL]  197.1 30.86 0 top
U4  XL74LS10  [SOP-14_L8.6-W3.9-P1.27-LS6.0-BL]  175.77 30.86 0 top
U5  XL74LS10  [SOP-14_L8.6-W3.9-P1.27-LS6.0-BL]  186.82 30.73 0 top
U6  74HC04D  [DIP-14_L19.2-W6.6-P2.54-LS10.9-BL]  205.1 16.38 0 top
W65C1  IC座-40P  [DIP-40_L50.8-W17.8-P2.54-LS15.2-BL]  22.99 57.53 180 top
W65C2  IC座-40P  [DIP-40_L50.8-W17.8-P2.54-LS15.2-BL]  75.56 57.53 180 top
W65C3  IC座-40P  [DIP-40_L50.8-W17.8-P2.54-LS15.2-BL]  179.32 57.53 180 top
W65C22  IC座-40P  [DIP-40_L50.8-W17.8-P2.54-LS15.2-BL]  127.13 57.53 180 top
XY1  PZ254V-11-04P  [HDR-TH_4P-P2.54-V-M]  26.54 88.77 0 top
XY2  PZ254V-11-04P  [HDR-TH_4P-P2.54-V-M]  50.67 81.03 0 top
Z  PZ254V-11-04P  [HDR-TH_4P-P2.54-V-M]  78.7 80.98 0 top

## Footprints (pads in the part's own frame, mm; a bottom-side part is the same pattern mirrored in y, then rotated)
DIP-14_L19.2-W6.6-P2.54-LS10.9-BL
  rect 1.6x1.6 hole 0.813: 1(-7.62,-4.2)
  round 1.6 hole 0.813: 2(-5.08,-4.2) 3(-2.54,-4.2) 4(0,-4.2) 5(2.54,-4.2) 6(5.08,-4.2) 7(7.62,-4.2) 8(7.62,4.2) 9(5.08,4.2) 10(2.54,4.2) 11(0,4.2) 12(-2.54,4.2) 13(-5.08,4.2) 14(-7.62,4.2)
DIP-28_L35.6-W10.2-P2.54-LS7.6-BL-2
  rect 1.8x1.8 hole 1: 1(-16.51,-3.81)
  round 1.8 hole 1: 2(-13.97,-3.81) 3(-11.43,-3.81) 4(-8.89,-3.81) 5(-6.35,-3.81) 6(-3.81,-3.81) 7(-1.27,-3.81) 8(1.27,-3.81) 9(3.81,-3.81) 10(6.35,-3.81) 11(8.89,-3.81) 12(11.43,-3.81) 13(13.97,-3.81) 14(16.51,-3.81) 15(16.51,3.81) 16(13.97,3.81) 17(11.43,3.81) 18(8.89,3.81) 19(6.35,3.81) 20(3.81,3.81) 21(1.27,3.81) 22(-1.27,3.81) 23(-3.81,3.81) 24(-6.35,3.81) 25(-8.89,3.81) 26(-11.43,3.81) 27(-13.97,3.81) 28(-16.51,3.81)
DIP-40_L50.8-W17.8-P2.54-LS15.2-BL
  rect 1.6x1.6 hole 1.1: 1(-24.13,-7.62)
  round 1.6 hole 1.1: 2(-21.59,-7.62) 3(-19.05,-7.62) 4(-16.51,-7.62) 5(-13.97,-7.62) 6(-11.43,-7.62) 7(-8.89,-7.62) 8(-6.35,-7.62) 9(-3.81,-7.62) 10(-1.27,-7.62) 11(1.27,-7.62) 12(3.81,-7.62) 13(6.35,-7.62) 14(8.89,-7.62) 15(11.43,-7.62) 16(13.97,-7.62) 17(16.51,-7.62) 18(19.05,-7.62) 19(21.59,-7.62) 20(24.13,-7.62) 21(24.125,7.62) 22(21.587,7.62) 23(19.045,7.62) 24(16.505,7.62) 25(13.965,7.62) 26(11.425,7.62) 27(8.885,7.62) 28(6.345,7.62) 29(3.81,7.62) 30(1.27,7.62) 31(-1.27,7.62) 32(-3.81,7.62) 33(-6.35,7.62) 34(-8.89,7.62) 35(-11.43,7.62) 36(-13.97,7.62) 37(-16.51,7.62) 38(-19.05,7.62) 39(-21.59,7.62) 40(-24.13,7.62)
FPC-SMD_14P-P0.50_XUNPU_FPC-05F-14PH15
  rect 0.3x1.1 smd: 1(-3.25,1.4) 2(-2.75,1.4) 3(-2.25,1.4) 4(-1.75,1.4) 5(-1.25,1.4) 6(-0.75,1.4) 7(-0.25,1.4) 8(0.25,1.4) 9(0.75,1.4) 10(1.25,1.4) 11(1.75,1.4) 12(2.25,1.4) 13(2.75,1.4) 14(3.25,1.4)
  rect 1.1x1.8 smd: 15(5.4,-1.4) 16(-5.4,-1.4)
HDR-TH_4P-P2.54-V-M
  rect 1.7x1.7 hole 1.1: 1(-3.81,0)
  round 1.7 hole 1.1: 2(-1.27,0) 3(1.27,0) 4(3.81,0)
Pad_e65
  round 1.524 hole 0.914: 1(0,0)
Pad_e66
  round 1.524 hole 0.914: 2(0,0)
Pad_e67
  round 1.524 hole 0.914: 3(0,0)
Pad_e68
  round 1.524 hole 0.914: 4(0,0)
R0603
  rect 0.806x0.864 smd: 1(-0.753,0) 2(0.753,0)
SOP-14_L8.6-W3.9-P1.27-LS6.0-BL
  oval 0.595x1.968 smd: 1(-3.81,-2.734) 2(-2.54,-2.734) 3(-1.27,-2.734) 4(0,-2.734) 5(1.27,-2.734) 6(2.54,-2.734) 7(3.81,-2.734) 8(3.81,2.734) 9(2.54,2.734) 10(1.27,2.734) 11(0,2.734) 12(-1.27,2.734) 13(-2.54,2.734) 14(-3.81,2.734)
SOP-16_L9.9-W3.9-P1.27-LS6.0-BL
  oval 0.574x2.038 smd: 1(-4.445,-2.769) 2(-3.175,-2.769) 3(-1.905,-2.769) 4(-0.635,-2.769) 5(0.635,-2.769) 6(1.905,-2.769) 7(3.175,-2.769) 8(4.445,-2.769) 9(4.445,2.769) 10(3.175,2.769) 11(1.905,2.769) 12(0.635,2.769) 13(-0.635,2.769) 14(-1.905,2.769) 15(-3.175,2.769) 16(-4.445,2.769)
SW-SMD_L3.9-W3.0-P4.45
  rect 1.23x1.36 smd: 1(-2.185,0) 2(2.185,0)

## Nets
5V: 65C02S.1 65C02S.2 65C02S.5 65C02S.6 65C02S.8 65C02S.35 AT28C64B.27 AT28C64B.28 AT28C64B#2.27 AT28C64B#2.28 CY7C199.28 R4.1 U1.15 U1.16 U2.14 U3.14 U4.14 U5.14 U6.14 W65C1.20 W65C1.24 W65C2.20 W65C2.24 W65C3.20 W65C3.24 W65C22.20 W65C22.24
12V: MoterCntroler.6 MoterControler.6 MoterControler#2.6 MoterControler#3.6
GND: 65C02S.21 AT28C64B.14 AT28C64B#2.14 CY7C199.14 MoterCntroler.5 MoterControler.5 MoterControler#2.5 MoterControler#3.5 U1.8 U2.7 U3.7 U4.7 U5.7 U6.7 W65C1.1 W65C2.1 W65C3.1 W65C22.1
A0: 65C02S.9 AT28C64B.10 AT28C64B#2.10 CY7C199.21 U2.5 U3.5 U4.9 U4.11 U4.13
A0B: U2.6 U3.1 U3.9 U3.13 U4.5
A1: 65C02S.10 AT28C64B.9 AT28C64B#2.9 CY7C199.23 U2.3 U3.2 U4.10
A1B: U2.4 U3.4 U3.10 U4.2 U4.4
A2: 65C02S.11 AT28C64B.8 AT28C64B#2.8 CY7C199.24 U2.1 U4.1 U4.3
A2B: U2.2 U3.3 U3.11
A3: 65C02S.12 AT28C64B.7 AT28C64B#2.7 CY7C199.25 U1.1 W65C1.38 W65C2.38 W65C3.38 W65C22.38
A4: 65C02S.13 AT28C64B.6 AT28C64B#2.6 CY7C199.26 U1.2 W65C1.37 W65C2.37 W65C3.37 W65C22.37
A5: 65C02S.14 AT28C64B.5 AT28C64B#2.5 CY7C199.1 U1.3 W65C1.36 W65C2.36 W65C3.36 W65C22.36
A6: 65C02S.15 AT28C64B.4 AT28C64B#2.4 CY7C199.2 W65C1.35 W65C2.35 W65C3.35 W65C22.35
A7: 65C02S.16 AT28C64B.3 AT28C64B#2.3 CY7C199.3
A8: 65C02S.17 AT28C64B.25 AT28C64B#2.25 CY7C199.4
A9: 65C02S.18 AT28C64B.24 AT28C64B#2.24 CY7C199.5
A10: 65C02S.19 AT28C64B.21 AT28C64B#2.2 AT28C64B#2.21 CY7C199.6
A11: 65C02S.20 AT28C64B.23 AT28C64B#2.23 CY7C199.7
A12: 65C02S.22 AT28C64B.2 CY7C199.8
A13: 65C02S.23 CY7C199.9 U2.9
A13B: U2.8 U5.13
A14: 65C02S.24 CY7C199.10 U2.11
A14B: U2.10 U5.2
A15: 65C02S.25 U2.13
A15B: U2.12 U5.1 U5.3 U5.4 U5.5
BUS0: R4.2 RES.1
D0: 65C02S.33 AT28C64B.11 AT28C64B#2.11 CY7C199.11 W65C1.33 W65C2.33 W65C3.33 W65C22.33
D1: 65C02S.32 AT28C64B.12 AT28C64B#2.12 CY7C199.12 W65C1.32 W65C2.32 W65C3.32 W65C22.32
D2: 65C02S.31 AT28C64B.13 AT28C64B#2.13 CY7C199.13 W65C1.31 W65C2.31 W65C3.31 W65C22.31
D3: 65C02S.30 AT28C64B.15 AT28C64B#2.15 CY7C199.15 W65C1.30 W65C2.30 W65C3.30 W65C22.30
D4: 65C02S.29 AT28C64B.16 AT28C64B#2.16 CY7C199.16 W65C1.29 W65C2.29 W65C3.29 W65C22.29
D5: 65C02S.28 AT28C64B.17 AT28C64B#2.17 CY7C199.17 W65C1.28 W65C2.28 W65C3.28 W65C22.28
D6: 65C02S.27 AT28C64B.18 AT28C64B#2.18 CY7C199.18 W65C1.27 W65C2.27 W65C3.27 W65C22.27
D7: 65C02S.26 AT28C64B.19 AT28C64B#2.19 CY7C199.19 W65C1.26 W65C2.26 W65C3.26 W65C22.26
D8: U1.13 U6.2
IRQB: 65C02S.4 W65C1.21 W65C2.21 W65C3.21 W65C22.21
LE: U1.14 U4.6
MC1C1: MoterControler#2.2 XY1.2
MC1C1B: MoterControler#2.1 XY1.1
MC1C2: MoterControler#2.4 XY1.4
MC1C2B: MoterControler#2.3 XY1.3
MC1FR: MoterControler#2.12 W65C1.15
MC1MD1: MoterControler#2.9 W65C1.12
MC1MD2: MoterControler#2.8 W65C1.11
MC1MD3: MoterControler#2.7 W65C1.10
MC1RES: MoterControler#2.11 W65C1.14
MC1ST: MoterControler#2.10 W65C1.13
MC1STP: MoterControler#2.13 W65C1.16
MC2: MoterControler.14
MC2C1: MoterControler.2 XY2.2
MC2C1B: MoterControler.1 XY2.1
MC2C2: MoterControler.4 XY2.4 Z.4
MC2C2B: MoterControler.3 XY2.3
MC2FR: MoterControler.12 W65C1.7
MC2MD1: MoterControler.9 W65C1.4
MC2MD2: MoterControler.8 W65C1.3
MC2MD3: MoterControler.7 W65C1.2
MC2RES: MoterControler.11 W65C1.6
MC2ST: MoterControler.10 W65C1.5
MC2STP: MoterControler.13 W65C1.8
MC3C1: MoterControler#3.2 Z.2
MC3C1B: MoterControler#3.1 Z.1
MC3C2: MoterControler#3.4
MC3C2B: MoterControler#3.3 Z.3
MC3FR: MoterControler#3.12 W65C2.15
MC3MD1: MoterControler#3.9 W65C2.12
MC3MD2: MoterControler#3.8 W65C2.11
MC3MD3: MoterControler#3.7 W65C2.10
MC3RES: MoterControler#3.11 W65C2.14
MC3ST: MoterControler#3.10 W65C2.13
MC3STP: MoterControler#3.13 W65C2.16
MC4C1: E.2 MoterCntroler.2
MC4C1B: E.1 MoterCntroler.1
MC4C2: E.4 MoterCntroler.4
MC4C2B: E.3 MoterCntroler.3
MC4FR: MoterCntroler.12 W65C2.7
MC4MD1: MoterCntroler.9 W65C2.4
MC4MD2: MoterCntroler.8 W65C2.3
MC4MD3: MoterCntroler.7 W65C2.2
MC4RES: MoterCntroler.11 W65C2.6
MC4ST: MoterCntroler.10 W65C2.5
MC4STP: MoterCntroler.13 W65C2.8
PHI2: 65C02S.36 W65C1.25 W65C2.25 W65C3.25 W65C22.25
RAMEB: CY7C199.20 CY7C199.22 U5.6
RAMOEB: CY7C199.27
RESB: 65C02S.40 RES.2 W65C1.34 W65C2.34 W65C3.34 W65C22.34
ROM1E: AT28C64B.20 AT28C64B.22 U5.12
ROM2E: AT28C64B#2.20 AT28C64B#2.22 U6.6
RWB: 65C02S.34 W65C1.22 W65C2.22 W65C3.22 W65C22.22
VIA0CA1: W65C1.40
VIA0CA2: W65C1.39
VIA0CB1: W65C1.18
VIA0CB2: W65C1.19
VIA0EB: U3.8 W65C1.23
VIA0PA7: W65C1.9
VIA0PB7: W65C1.17
VIA1CA1: W65C2.40
VIA1CA2: W65C2.39
VIA1CB1: W65C2.18
VIA1CB2: W65C2.19
VIA1E: U3.12
VIA1EB: W65C2.23
VIA1PA7: W65C2.9
VIA1PB7: W65C2.17
VIA2CA1: W65C22.40
VIA2CA2: W65C22.39
VIA2CB1: W65C22.18
VIA2CB2: W65C22.19
VIA2EB: W65C22.23
VIA2PA0: W65C22.2
VIA2PA1: W65C22.3
VIA2PA2: W65C22.4
VIA2PA3: W65C22.5
VIA2PA4: W65C22.6
VIA2PA5: W65C22.7
VIA2PA6: W65C22.8
VIA2PA7: W65C22.9
VIA2PB0: W65C22.10
VIA2PB1: W65C22.11
VIA2PB2: W65C22.12
VIA2PB3: W65C22.13
VIA2PB4: W65C22.14
VIA2PB5: W65C22.15
VIA2PB6: W65C22.16
VIA2PB7: W65C22.17
VIA3CA1: W65C3.40
VIA3CA2: W65C3.39
VIA3CB2: W65C3.19
VIA3EB: U4.8 W65C3.23
WEB: U6.4
$2N10633: U3.6
$2N12247: U1.4 U6.5
$2N12601: U1.5 U6.3

Pads without a net: 65C02S 3 7 37 38 39; AT28C64B 1 26; AT28C64B#2 1 26; MoterCntroler 14 15 16; MoterControler 15 16; MoterControler#2 14 15 16; MoterControler#3 14 15 16; NOREF 1; NOREF#2 2; NOREF#3 3; NOREF#4 4; U1 6 7 9 10 11 12; U4 12; U5 8 9 10 11; U6 1 8 9 10 11 12 13; W65C3 2 3 4 5 6 7 8 9 10 11 12 13 14 15 16 17 18

## Via types
v1: diameter 0.61, hole 0.305, Top Layer to Bottom Layer, 41 vias

## Routing (per net, layer and track width the routed paths; a pad name or vN(x,y) marks a point on that pad's centre or on a via; arc(x,y) is an arc through that point)
5V:
  vias: v1(0,10.38)
12V:
  vias: v1(12.32,87.38) v1(40.89,87.38)
GND:
  vias: v1(41.53,39.75)
A8: length 133.7
  Inner2 w0.254: v1(97.12,-2.62) 97.12,-2.19 AT28C64B.25
  Bottom Layer w0.254: 65C02S.17 46.74,-2.62 81.02,-2.62 ; 63.04,-2.62 63.58,-2.62 CY7C199.4 ; 81.02,-2.62 167.61,-2.62
A9: length 135.9
  Inner1 w0.254: 104.36,-6.73 104.36,2.5 AT28C64B.24
  Inner2 w0.254: 64.52,-6.73 64.52,-6.6 CY7C199.5
  Bottom Layer w0.254: 65C02S.18 51,-6.73 167.62,-6.73
  vias: v1(64.45,-6.73)
A10: length 131.5
  Inner1 w0.254: 112.03,-6.1 112.03,2.56 AT28C64B.21
  Inner2 w0.254: 67.69,-6.1 67.69,-5.97 CY7C199.6
  Bottom Layer w0.254: 65C02S.19 52.91,-6.1 167.62,-6.1
  vias: v1(67.68,-6.1)
A11: length 127.1
  Inner1 w0.254: 106.93,-5.46 106.93,2.53 AT28C64B.23
  Inner2 w0.254: 70.87,-5.46 70.87,-5.33 CY7C199.7
  Bottom Layer w0.254: 65C02S.20 54.81,-5.46 167.51,-5.46
  vias: v1(70.89,-5.46)
A12: length 143.3
  Inner2 w0.254: 65C02S.22 51.94,10.1 51.94,-4.57 v1(54.74,-7.37) ; 71.5,-7.37 71.5,-7.24 74.93,-3.81 ; 94.61,-7.37 94.61,-7.24 AT28C64B.2
  Bottom Layer w0.254: v1(54.74,-7.37) 167.56,-7.37
  vias: v1(71.51,-7.37)
A13: length 141.9
  Inner2 w0.254: 65C02S.23 49.4,10.1 49.4,-4.57 v1(52.83,-8) ; v1(73.41,-8) 73.41,-7.87 CY7C199.9
  Bottom Layer w0.254: v1(52.83,-8) 167.51,-8
A14: length 145.8
  Inner2 w0.254: 65C02S.24 46.74,10.23 46.74,-4.57 v1(50.8,-8.64) ; 75.31,-8.64 75.31,-8.51 CY7C199.10
  Bottom Layer w0.254: v1(50.8,-8.64) 167.59,-8.64
  vias: v1(75.36,-8.64)
A15: length 141.8
  Inner2 w0.254: 65C02S.25 44.32,10.1 44.32,-4.57 v1(49.15,-9.4)
  Bottom Layer w0.254: v1(49.15,-9.4) 167.59,-9.4
D1: length 154.5
  Top Layer w0.254: 25.23,11.64 v1(25.23,15.49) ; v1(30,45.59) v1(28.19,45.59)
  Inner1 w0.254: v1(25.23,15.49) 25.23,48.34 W65C1.32 26.8,46.99 v1(28.19,45.59) ; v1(30,45.59) v1(75.06,45.59)
  Inner2 w0.254: W65C2.32 v1(75.06,45.59) 126.62,45.59 W65C22.32
D2: length 157.9
  Top Layer w0.254: v1(24.51,17.78) 27.77,14.52 65C02S.31
  Inner1 w0.254: W65C1.31 24.26,18.03 v1(24.51,17.78)
  Inner2 w0.254: W65C1.31 24.26,48.13 28.19,44.2 v1(71.12,44.2) ; v1(71.12,44.2) W65C2.31 ; v1(71.12,44.2) v1(122.68,44.2)
  Bottom Layer w0.254: W65C22.31 v1(122.68,44.2)
D3: length 208.6
  Top Layer w0.254: 23.11,20.19 30.31,13 65C02S.30
  Inner1 w0.254: W65C1.30 22.99,48.64 v1(22.99,20.32) ; v1(68.71,43.56) v1(68.71,25.4)
  Inner2 w0.254: W65C1.30 28.07,43.56 v1(68.71,43.56) v1(119.51,43.56) ; v1(68.71,25.4) 68.71,25.27 CY7C199.15
  Bottom Layer w0.254: v1(68.71,43.56) 74.29,49.15 W65C2.30 ; W65C22.30 v1(119.51,43.56)
D4: length 212.6
  Top Layer w0.254: v1(21.97,22.22) 32.77,11.42 65C02S.29
  Inner1 w0.254: W65C1.29 19.18,25.02 v1(21.97,22.22)
  Inner2 w0.254: W65C1.29 26.16,42.93 v1(64.77,42.93) v1(116.33,42.93) ; v1(64.77,40.13) 64.77,26.67 CY7C199.16
  Bottom Layer w0.254: v1(64.77,40.13) v1(64.77,42.93) W65C2.29 ; W65C22.29 v1(116.33,42.93)
D5: length 216
  Top Layer w0.254: v1(18.41,27.56) 34.55,11.42 65C02S.28
  Inner1 w0.254: W65C1.28 16.64,29.33 v1(18.41,27.56)
  Inner2 w0.254: 16.84,49.91 24.46,42.29 v1(61.6,42.29) ; 61.59,42.29 113.16,42.29 ; v1(61.6,40.22) 61.6,27.3 CY7C199.17
  Bottom Layer w0.254: v1(61.6,42.29) 61.59,42.29 ; v1(61.6,42.29) v1(61.6,40.22) ; v1(61.6,42.29) W65C2.28 ; 113.16,42.29 113.28,42.42 113.29,42.42 W65C22.28
D6: length 218.9
  Top Layer w0.254: 15.49,33.91 v1(15.49,33.85) 65C02S.27
  Inner1 w0.254: W65C1.27 14.1,35.24 v1(15.49,33.85)
  Inner2 w0.254: W65C1.27 22.36,41.66 58.41,41.66 ; v1(58.41,40.26) 58.41,27.95 82.55,3.81 ; v1(58.42,41.66) v1(109.98,41.66)
  Bottom Layer w0.254: 58.41,41.66 v1(58.41,40.26) ; 58.42,41.66 v1(58.42,41.66) W65C2.27 ; v1(109.98,41.66) 109.99,41.66 W65C22.27
D7: length 222.4
  Top Layer w0.254: v1(13.33,40.51) 40.46,13.39 65C02S.26
  Inner1 w0.254: 11.56,50.34 11.56,42.29 v1(13.33,40.51)
  Inner2 w0.254: 11.56,49.8 20.34,41.02 v1(55.25,41.02) ; v1(55.25,41.02) 55.25,28.57 CY7C199.19 ; v1(55.25,41.02) v1(106.81,41.02)
  Bottom Layer w0.254: 55.24,41.02 v1(55.25,41.02) W65C2.26 ; 106.81,41.02 v1(106.81,41.02) W65C22.26
RWB: length 201.7
  Inner2 w0.254: W65C1.22 20.15,31.16 20.15,16.08 ; 20.15,16.08 65C02S.34 ; 20.15,16.08 43.56,39.5
  Bottom Layer w0.254: 43.56,39.5 v1(43.56,39.5) W65C2.22 55.25,51.18 59.41,51.18 ; 57.79,51.18 104.27,51.18 W65C22.22 105.54,50.04 106.68,51.18 156.47,51.18 W65C3.22
A0: length 23.9
  Inner2 w0.254: 111.98,5.08 111.98,2.57 AT28C64B.10
  Bottom Layer w0.254: 65C02S.9 31.97,2.92 32,2.92 ; 72.71,5.08 73.66,5.08 74.93,3.81
A1: length 154.1
  Inner2 w0.254: 66.99,1.27 67.31,1.27 CY7C199.23 ; 110.24,1.91 110.24,1.78 AT28C64B.9
  Bottom Layer w0.254: 65C02S.10 33.49,1.91 167.61,1.91
A2: length 151
  Inner2 w0.254: 64.14,0.63 64.14,0.64 CY7C199.24 ; 108.46,1.27 108.46,1.02 AT28C64B.8
  Bottom Layer w0.254: 65C02S.11 35.39,1.27 167.61,1.27
A3: length 148.2
  Inner2 w0.254: 60.94,0 60.96,0 CY7C199.25 ; 106.43,0.63 106.43,0.51 AT28C64B.7
  Bottom Layer w0.254: 65C02S.12 37.3,0.63 167.61,0.63
A4: length 144.5
  Inner2 w0.254: 58.4,0 58.42,0 CY7C199.26 ; 104.65,0 104.65,-0.25 AT28C64B.6
  Bottom Layer w0.254: 65C02S.13 39.2,0 167.61,0
A5: length 139.8
  Inner2 w0.254: 54,-0.67 54.01,-0.67 57.15,-3.81 ; 102.62,-0.67 102.62,-0.76 AT28C64B.5
  Bottom Layer w0.254: 37.93,-3.69 40.94,-0.67 167.61,-0.67
A6: length 135.1
  Inner2 w0.254: 57.15,-1.4 57.28,-1.4 CY7C199.2 ; 100.84,-1.4 100.84,-1.52 AT28C64B.4
  Bottom Layer w0.254: 65C02S.15 42.89,-1.4 167.63,-1.4
A7: length 130.4
  Inner2 w0.254: 60.4,-2.03 60.45,-2.03 CY7C199.3 ; 98.89,-2.03 98.89,-2.11 AT28C64B.3
  Bottom Layer w0.254: 65C02S.16 44.79,-2.03 167.61,-2.03
BUS0: length 2.3
  Top Layer w0.254: R4.2 RES.1
D0: length 206.5
  Inner1 w0.254: 65C02S.33 29.34,18.07 W65C1.33 33.02,46.23 78.23,46.23 ; 78.23,46.23 W65C2.33 ; 78.23,46.23 83.82,40.64 83.82,-2.54 82.55,-3.81 ; 78.23,46.23 129.79,46.23 W65C22.33
IRQB: length 226.2
  Top Layer w0.254: 48.65,47.12 1.66,47.12 W65C1.21 11.18,37.6 11.18,-2.47 65C02S.4 ; 48.65,47.12 W65C2.21 ; 48.65,47.12 100.46,47.12 ; 103,49.91 100.21,47.12 152.4,47.12 W65C3.21
PHI2: length 201.4
  Inner1 w0.254: 65C02S.36 9.02,17.47 W65C1.25 10.67,51.56 59.95,51.56 W65C2.25 63.25,51.56 111.51,51.56 113.16,49.91 114.81,51.56 163.71,51.56 W65C3.25
RAMEB: length 6.1
  Inner1 w0.254: CY7C199.22 73.66,2.54 76.2,2.54 CY7C199.20
RESB: length 256.4
  Top Layer w0.254: RES.2 4.91,13.66 65C02S.40
  Bottom Layer w0.254: W65C1.34 31.88,38.39 ; 31.88,38.39 65C02S.40 ; 31.88,38.39 72.94,38.39 W65C2.34 ; 68.94,38.39 124.5,38.39 W65C22.34 ; 124.59,38.35 176.66,38.35 W65C3.34

# Board PCB2
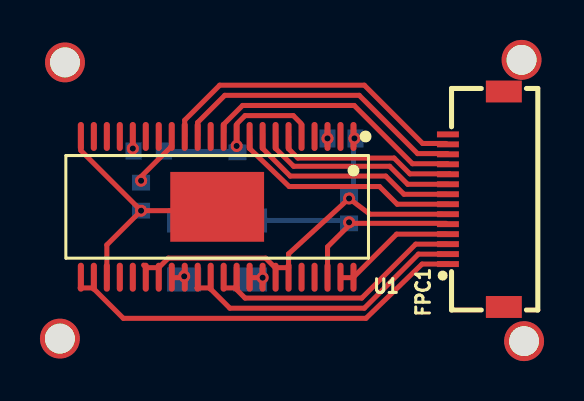
[diagram p4: board, top side]
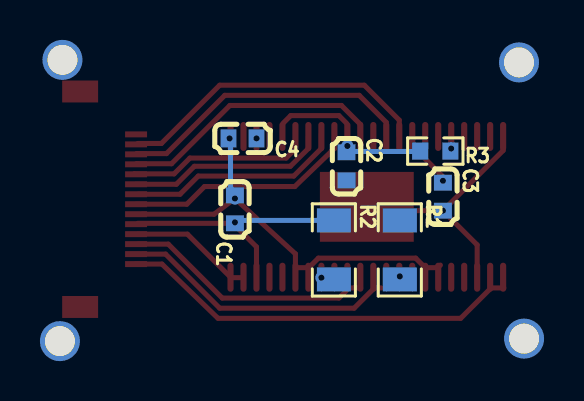
[diagram p5: board, bottom side, seen from below]

No outline. copper layers: Top Layer, Bottom Layer. Coordinates in mm from the lowest, leftmost part position.
Stack: Top Layer 0.035mm / Dielectric1 1.51mm FR4 er 4.5 / Bottom Layer 0.035mm

## Design rules (mm)
template: JLCPCB Capability(Two Layers Board)
spacing copperThickness1oz (default): track to track 0.102, other pairs 0.152 to 0.3
spacing copperThickness2oz: track to track 0.203, other pairs 0.152 to 0.3
track width copperThickness1oz (default): min 0.127, default 0.254, max 2.54
track width copperThickness2oz: min 0.203, default 0.254, max 2.54
differential pair differentialPair (default): width min 0.127, default 0.254, max 2.54; gap min 0.152, default 0.152
via viaSize (default): diameter min 0.5, default 0.61, max 10; hole min 0.3, default 0.305, max 6.3

## Placement (name value [footprint] x y rotation side)
C1  10uF  [C0603]  14.48 6.6 90 bottom
C2  100pF  [C0603]  8.89 8.76 270 bottom
C3  180pF  [C0603]  4.06 7.24 270 bottom
C4  100pF  [C0603]  14.1 10.16 0 bottom
FPC1  FPC-05F-14PH15  [FPC-SMD_14P-P0.50_XUNPU_FPC-05F-14PH15]  20.83 7.11 90 top
NOREF  -  [Pad_e9]  23.24 0 0 top
NOREF#2  -  [Pad_e12]  0.25 13.97 0 top
NOREF#3  -  [Pad_e10]  0 0.13 0 top
NOREF#4  -  [Pad_e11]  23.11 14.1 0 top
R1  220mΩ  [R1206]  6.22 4.57 270 bottom
R2  220mΩ  [R1206]  9.53 4.57 270 bottom
R3  51kΩ  [R0603]  4.44 9.53 0 bottom
U1  LV8729V-TLM-H  [SSOP-44_L15.5-W5.6-P0.65-LS7.6-BL-EP]  7.87 6.73 180 top

## Footprints (pads in the part's own frame, mm; a bottom-side part is the same pattern mirrored in y, then rotated)
C0603
  rect 0.8x0.9 smd: 1(-0.7,0) 2(0.7,0)
FPC-SMD_14P-P0.50_XUNPU_FPC-05F-14PH15
  rect 0.3x1.1 smd: 1(-3.25,1.4) 2(-2.75,1.4) 3(-2.25,1.4) 4(-1.75,1.4) 5(-1.25,1.4) 6(-0.75,1.4) 7(-0.25,1.4) 8(0.25,1.4) 9(0.75,1.4) 10(1.25,1.4) 11(1.75,1.4) 12(2.25,1.4) 13(2.75,1.4) 14(3.25,1.4)
  rect 1.1x1.8 smd: 15(5.4,-1.4) 16(-5.4,-1.4)
Pad_e9
  round 2 hole 1.5: 1(0,0)
Pad_e10
  round 2 hole 1.5: 2(0,0)
Pad_e11
  round 2 hole 1.5: 3(0,0)
Pad_e12
  round 2 hole 1.5: 4(0,0)
R0603
  rect 0.806x0.864 smd: 1(-0.753,0) 2(0.753,0)
R1206
  rect 1.208x1.701 smd: 1(-1.479,0) 2(1.479,0)
SSOP-44_L15.5-W5.6-P0.65-LS7.6-BL-EP
  oval 0.308x1.454 smd: 1(-6.825,-3.527) 2(-6.175,-3.527) 3(-5.525,-3.527) 4(-4.875,-3.527) 5(-4.225,-3.527) 6(-3.575,-3.527) 7(-2.925,-3.527) 8(-2.275,-3.527) 9(-1.625,-3.527) 10(-0.975,-3.527) 11(-0.325,-3.527) 12(0.325,-3.527) 13(0.975,-3.527) 14(1.625,-3.527) 15(2.275,-3.527) 16(2.925,-3.527) 17(3.575,-3.527) 18(4.225,-3.527) 19(4.875,-3.527) 20(5.525,-3.527) 21(6.175,-3.527) 22(6.825,-3.527) 23(6.825,3.527) 24(6.175,3.527) 25(5.525,3.527) 26(4.875,3.527) 27(4.225,3.527) 28(3.575,3.527) 29(2.925,3.527) 30(2.275,3.527) 31(1.625,3.527) 32(0.975,3.527) 33(0.325,3.527) 34(-0.325,3.527) 35(-0.975,3.527) 36(-1.625,3.527) 37(-2.275,3.527) 38(-2.925,3.527) 39(-3.575,3.527) 40(-4.225,3.527) 41(-4.875,3.527) 42(-5.525,3.527) 43(-6.175,3.527) 44(-6.825,3.527)
  rect 4.7x3.5 smd: 45(0,0)

## Nets
12V: C1.2 C4.2 FPC1.6 U1.1 U1.28 U1.29 U1.38 U1.39
GND: C1.1 C2.2 C3.2 FPC1.5 R1.1 R2.1 U1.22 U1.25 U1.42 U1.45
C1: FPC1.2 U1.32 U1.33
C1B: FPC1.1 U1.23 U1.24
C2: FPC1.4 U1.43 U1.44
C2B: FPC1.3 U1.34 U1.35
FR: FPC1.12 U1.13
MD1: FPC1.9 U1.7
MD2: FPC1.8 U1.8
MD3: FPC1.7 U1.9
RES: FPC1.11 U1.11
ST: FPC1.10 U1.6
STP: FPC1.13 U1.14
$2N1474: R3.1 U1.18
$2N1496: R1.2 U1.30 U1.31
$2N1498: R2.2 U1.36 U1.37
$2N2039: C4.1 U1.3
$2N2111: C3.1 U1.15
$2N2921: C2.1 R3.2 U1.5 U1.10

Pads without a net: FPC1 14 15 16; NOREF 1; NOREF#2 4; NOREF#3 2; NOREF#4 3; U1 2 4 12 16 17 19 20 21 26 27 40 41

## Via types
v1: diameter 0.61, hole 0.305, Top Layer to Bottom Layer, 10 vias

## Routing (per net, layer and track width the routed paths; a pad name or vN(x,y) marks a point on that pad's centre or on a via; arc(x,y) is an arc through that point)
12V: length 19.8
  Top Layer w0.254: 4.19,3.81 4.32,3.68 4.95,3.68 5.43,4.16 10.3,4.16 10.78,3.68 11.45,3.68 11.45,4.38 v1(14.48,7.15) 15.52,6.36 19.12,6.36
  Bottom Layer w0.254: 14.48,7.46 14.7,7.68 14.7,9.78
  vias: v1(14.75,10.16)
GND: length 22.9
  Top Layer w0.254: 1.05,9.78 1.05,9.55 v1(4.06,6.54) ; v1(4.06,6.54) 2.35,4.82 2.35,3.68 ; v1(4.06,6.54) 5.95,6.54 ; U1.42 13.4,4.72 14.48,5.8 ; C1.1 19.34,5.9
  Bottom Layer w0.254: 9.53,6.05 14.33,6.05 C1.1
  vias: v1(14.48,5.95)
$2N1474:
  vias: v1(3.65,9.65)
$2N1496: length 0.6
  Top Layer w0.254: 5.6,3.18 6.25,3.18
  vias: v1(6.22,3.25)
$2N1498: length 0.7
  Top Layer w0.254: 9.5,3.18 10.13,3.18 U1.37
  vias: v1(10.15,3.18)
$2N2039:
  vias: v1(13.4,10.16)
$2N2111: length 2.4
  Top Layer w0.254: 4.06,8 4.06,8.25 5.6,9.78
  vias: v1(4.06,8.04)
$2N2921: length 6.8
  Top Layer w0.254: 8.89,10.92 9.27,11.3 11.68,11.3 12.06,10.92
  Bottom Layer w0.254: 5.32,9.51 8.53,9.51 8.64,9.4
  vias: v1(8.85,9.78)
C1: length 13.8
  Top Layer w0.254: 6.88,2.67 7.49,2.67 8.51,1.65 15.24,1.65 17.95,4.36 19.09,4.36
C1B: length 20.1
  Top Layer w0.254: 1.02,2.67 1.65,2.67 3.18,1.14 15.32,1.14 18.13,3.86 FPC1.1
C2: length 6.2
  Top Layer w0.254: 14.05,3.18 14.7,3.18 ; 14.7,3.2 16.86,5.36 19.34,5.36
C2B: length 12.5
  Top Layer w0.254: 8.89,2.67 8.19,2.67 ; 8.83,2.6 9.27,2.16 15.11,2.16 17.82,4.86 19.34,4.86
FR: length 15
  Top Layer w0.254: 6.9,10.28 6.9,10.96 8.25,12.32 14.99,12.32 17.91,9.4 19.39,9.4 FPC1.12
MD1: length 10
  Top Layer w0.254: U1.7 10.8,9.66 11.7,8.76 16.51,8.76 17.41,7.86 FPC1.9
MD2: length 10.9
  Top Layer w0.254: 10.15,10.38 10.15,9.66 11.53,8.27 16.31,8.27 17.22,7.36 19.34,7.36
MD3: length 11.7
  Top Layer w0.254: U1.9 9.5,9.65 11.48,7.75 16,7.75 16.89,6.86 FPC1.7
RES: length 13.2
  Top Layer w0.254: 8.2,10.48 8.2,10.87 9.14,11.81 14.73,11.81 17.65,8.89 19.4,8.89 FPC1.11
ST: length 9.2
  Top Layer w0.254: U1.6 11.45,9.64 11.91,9.18 16.73,9.18 17.53,8.38 19.52,8.38 19.54,8.36
STP: length 15.8
  Top Layer w0.254: 6.25,10.28 6.25,11.07 8,12.83 15.24,12.83 18.16,9.91 19.34,9.91
